# Altium schematic sheet Power.SCHDOC
size 297 x 209 mm; SheetNumber: 1; SheetTotal: 5; DocumentName: Power.SCHDOC
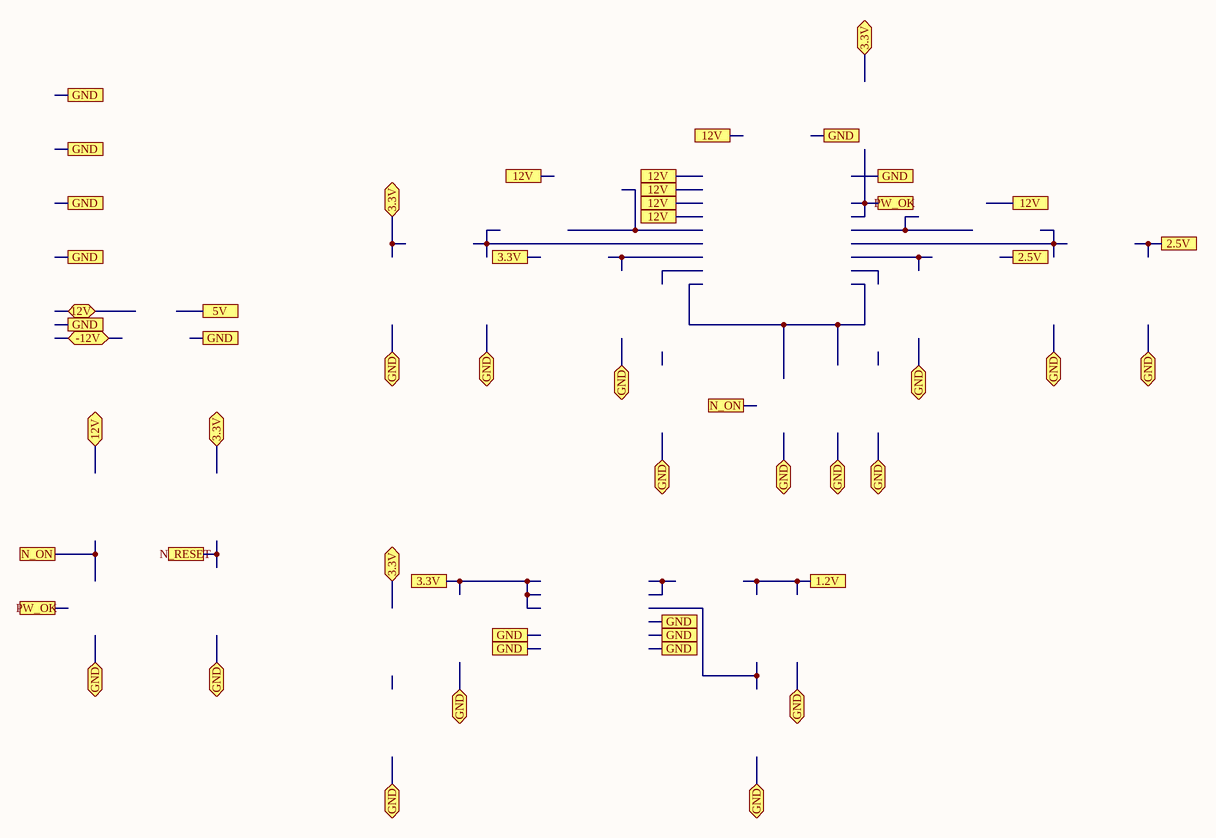
[diagram p0: Power.SCHDOC]

## Ports
1.2V, 2.5V, 3.3V, 5V, 12V, 12V (bidir), -12V (bidir), GND, N_ON, N_RESET, PW_OK

## Notes on the sheet
- A
- B
- C
- D
- 1
- 2
- 3
- Title
- 4
- Size
- A4
- Number
- Rev
- Date
- Filename
- Drawn by
- Sheet
- of